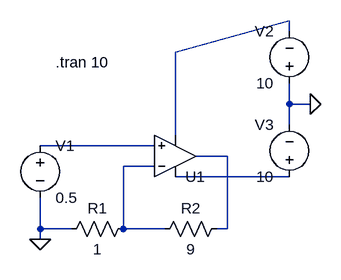
[diagram p0: schematic Draft3.asc]
Draft3.asc, the LTspice schematic file:
Version 4
SHEET 1 880 680
WIRE 624 64 624 48
WIRE 448 96 624 48
WIRE 624 176 624 144
WIRE 656 176 624 176
WIRE 624 208 624 176
WIRE 448 224 448 96
WIRE 416 240 240 240
WIRE 528 256 480 256
WIRE 416 272 368 272
WIRE 624 288 448 288
WIRE 240 368 240 320
WIRE 288 368 240 368
WIRE 368 368 368 272
WIRE 432 368 368 368
WIRE 528 368 528 256
WIRE 528 368 512 368
WIRE 240 384 240 368
FLAG 240 384 0
FLAG 656 176 0
SYMBOL UniversalOpamp2 448 256 M180
SYMATTR InstName U1
SYMBOL voltage 240 224 R0
SYMATTR InstName V1
SYMATTR Value 0.5
SYMBOL res 384 352 R90
WINDOW 0 0 56 VBottom 2
WINDOW 3 32 56 VTop 2
SYMATTR InstName R1
SYMATTR Value 1
SYMBOL res 528 352 R90
WINDOW 0 0 56 VBottom 2
WINDOW 3 32 56 VTop 2
SYMATTR InstName R2
SYMATTR Value 9
SYMBOL voltage 624 160 R180
WINDOW 0 24 96 Left 2
WINDOW 3 24 16 Left 2
SYMATTR InstName V2
SYMATTR Value 10
SYMBOL voltage 624 304 R180
WINDOW 0 24 96 Left 2
WINDOW 3 24 16 Left 2
SYMATTR InstName V3
SYMATTR Value 10
TEXT 264 112 Left 2 !.tran 10

The netlist it stands for:
* Draft3.asc
XU1 N002 N004 N005 N001 N003 level.2 Avol=1Meg GBW=10Meg Slew=10Meg ilimit=25m rail=0 Vos=0 phimargin=45 en=0 enk=0 in=0 ink=0 Rin=500Meg  ; pins IN+ IN- V+ V- OUT
V1 N002 0 0.5
R1 N004 0 1
R2 N003 N004 9
V2 0 N001 10
V3 N005 0 10
.tran 10
.lib UniversalOpamps2.sub
.backanno
.end